# Altium schematic sheet Camera.SchDoc
size A3
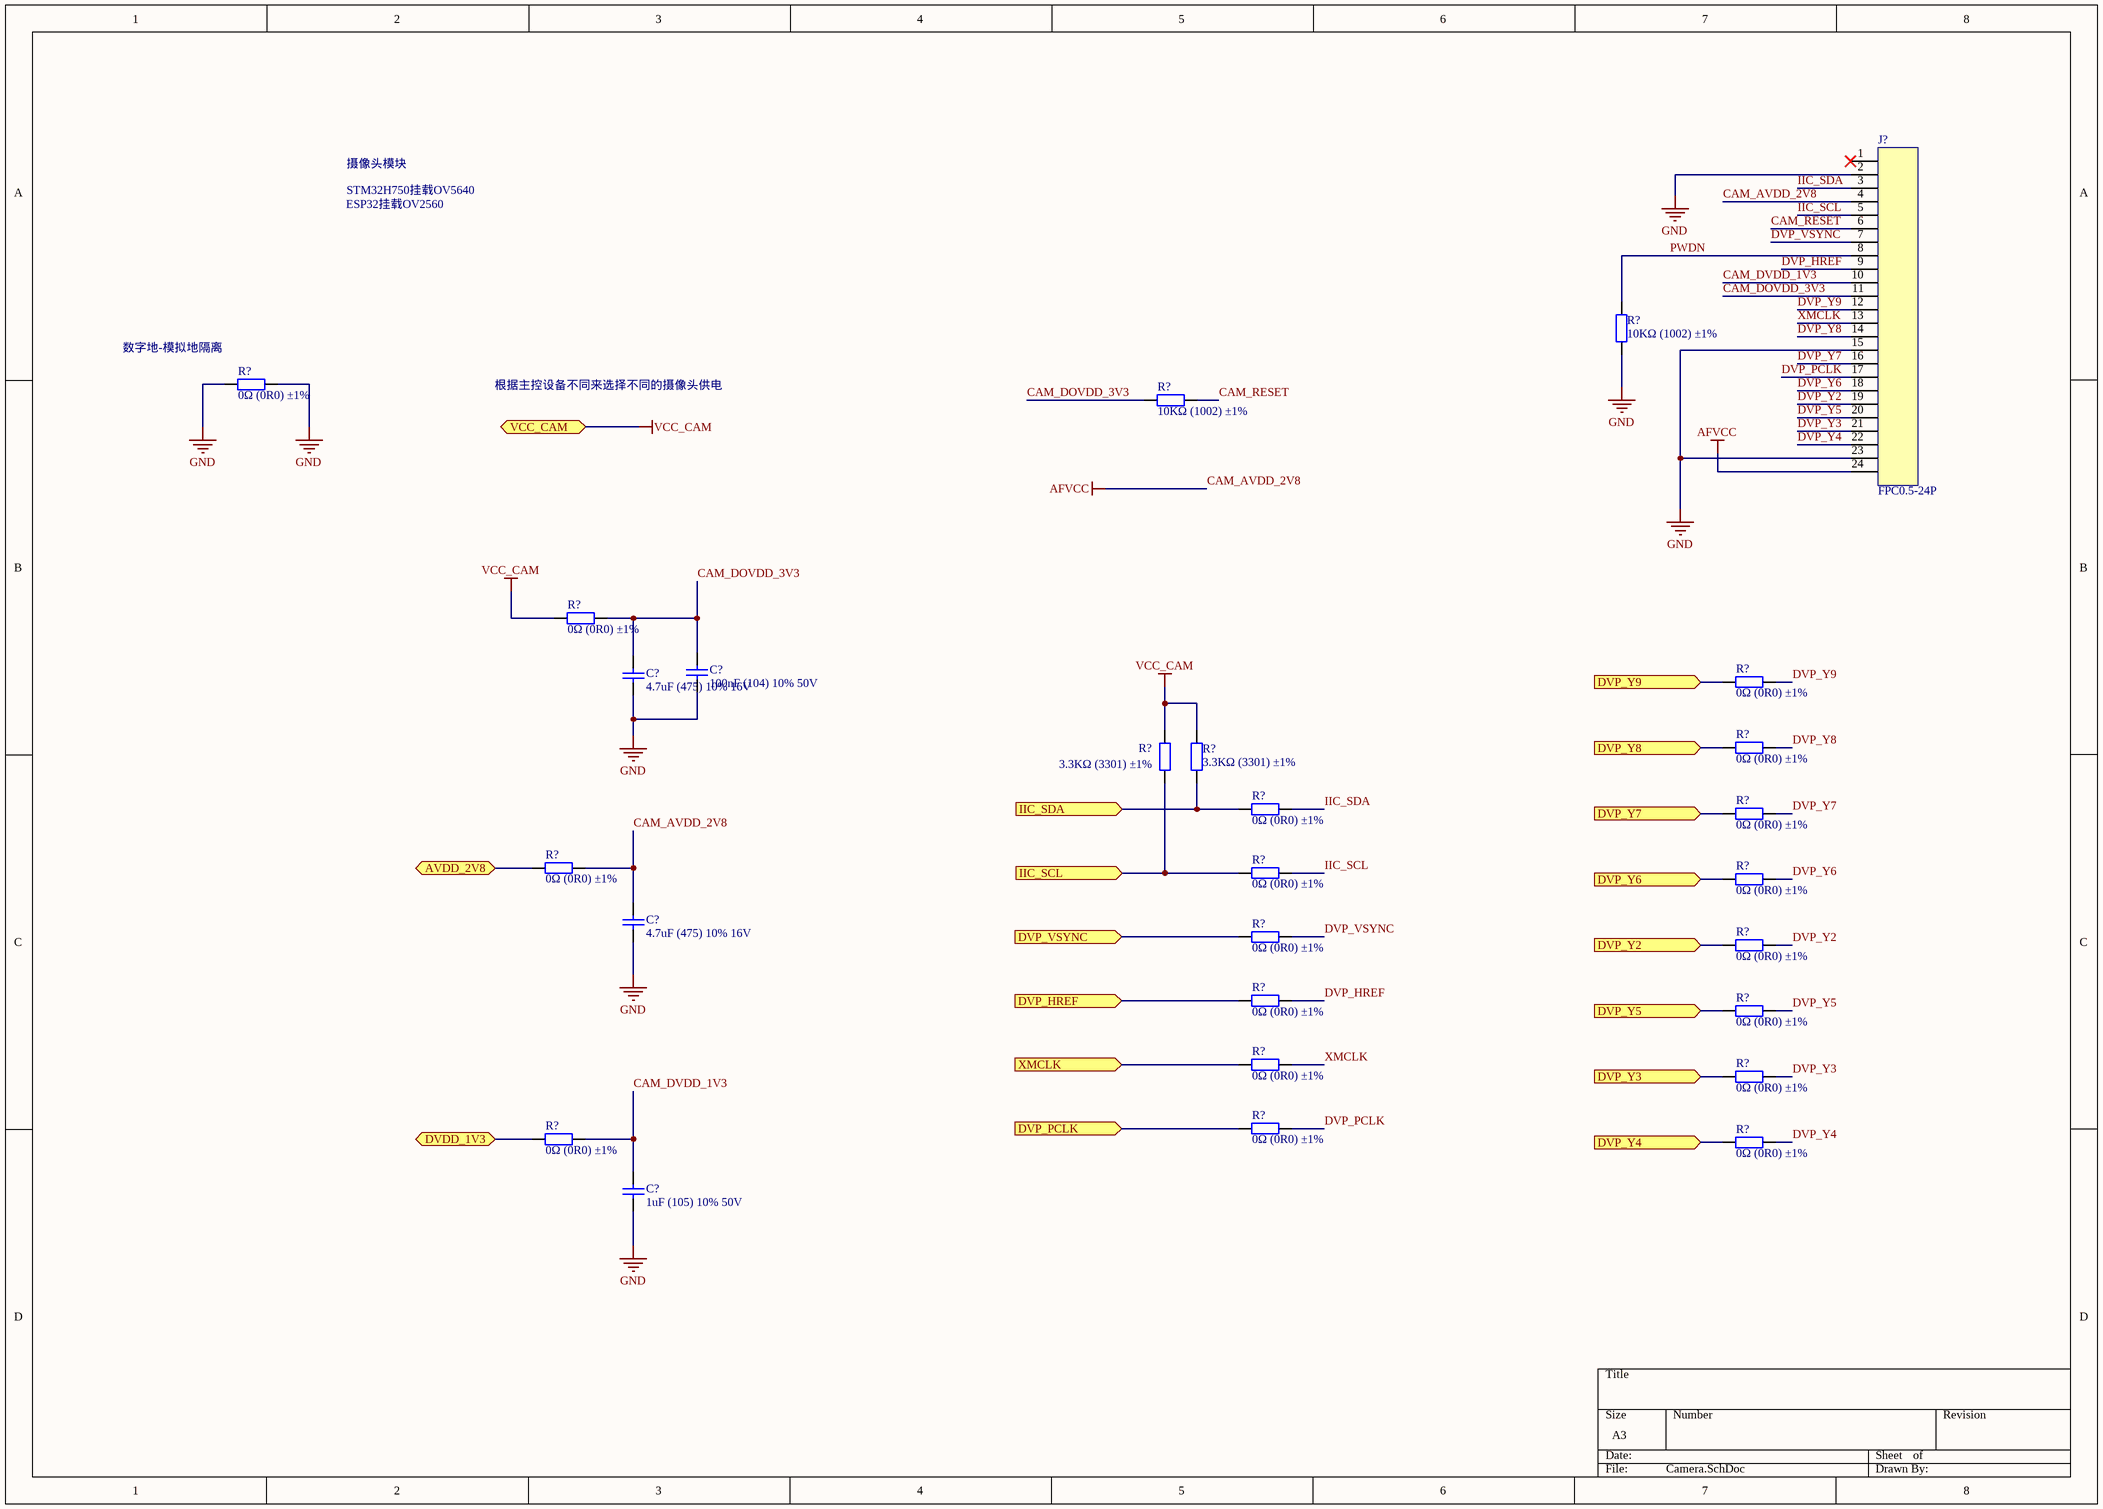
[diagram p0: Camera.SchDoc]

## Parts
(Parts that share a designator on the sheet are numbered #1, #2 ... from top to bottom, then left to right.)
C?#1  4.7uF (475) 10% 16V  [0603_C]
C?#2  100nF (104) 10% 50V  [0603_C]
C?#3  4.7uF (475) 10% 16V  [0603_C]
C?#4  1uF (105) 10% 50V  [0603_C]
J?  FPC0.5-24P  [FPC0.5-24P]
R?#1  10KΩ (1002) ±1%  [0603_R]
R?#2  0Ω (0R0) ±1%  [0603_R]
R?#3  10KΩ (1002) ±1%  [0603_R]
R?#4  0Ω (0R0) ±1%  [0603_R]
R?#5  0Ω (0R0) ±1%  [0603_R]
R?#6  0Ω (0R0) ±1%  [0603_R]
R?#7  3.3KΩ (3301) ±1%  [0603_R]
R?#8  3.3KΩ (3301) ±1%  [0603_R]
R?#9  0Ω (0R0) ±1%  [0603_R]
R?#10  0Ω (0R0) ±1%  [0603_R]
R?#11  0Ω (0R0) ±1%  [0603_R]
R?#12  0Ω (0R0) ±1%  [0603_R]
R?#13  0Ω (0R0) ±1%  [0603_R]
R?#14  0Ω (0R0) ±1%  [0603_R]
R?#15  0Ω (0R0) ±1%  [0603_R]
R?#16  0Ω (0R0) ±1%  [0603_R]
R?#17  0Ω (0R0) ±1%  [0603_R]
R?#18  0Ω (0R0) ±1%  [0603_R]
R?#19  0Ω (0R0) ±1%  [0603_R]
R?#20  0Ω (0R0) ±1%  [0603_R]
R?#21  0Ω (0R0) ±1%  [0603_R]
R?#22  0Ω (0R0) ±1%  [0603_R]

## Ports
AVDD_2V8 (bidir), DVDD_1V3 (bidir), DVP_HREF (in), DVP_PCLK (in), DVP_VSYNC (in), DVP_Y2 (in), DVP_Y3 (in), DVP_Y4 (in), DVP_Y5 (in), DVP_Y6 (in), DVP_Y7 (in), DVP_Y8 (in), DVP_Y9 (in), IIC_SCL (in), IIC_SDA (in), VCC_CAM (bidir), XMCLK (in)

## Nets
CAM_AVDD_2V8: C?#3.2 J?.4 J?.24 R?#11.1  [also labelled AFVCC]
GND: C?#1.1 C?#2.1 C?#3.1 C?#4.1 J?.2 J?.15 J?.23 R?#1.1 R?#2.1 R?#2.2
VCC_CAM: R?#4.2 R?#7.2 R?#8.2 ; port VCC_CAM
AVDD_2V8: R?#11.2 ; port AVDD_2V8
CAM_DOVDD_3V3: C?#1.2 C?#2.2 J?.11 R?#3.1 R?#4.1
CAM_DVDD_1V3: C?#4.2 J?.10 R?#21.1
CAM_RESET: J?.6 R?#3.2
DVDD_1V3: R?#21.2 ; port DVDD_1V3
DVP_HREF: R?#16.2 ; port DVP_HREF
DVP_HREF: J?.9 R?#16.1  [a separate net that carries the same name]
DVP_PCLK: R?#20.2 ; port DVP_PCLK
DVP_PCLK: J?.17 R?#20.1  [a separate net that carries the same name]
DVP_VSYNC: R?#14.2 ; port DVP_VSYNC
DVP_VSYNC: J?.7 R?#14.1  [a separate net that carries the same name]
DVP_Y2: R?#15.2 ; port DVP_Y2
DVP_Y2: J?.19 R?#15.1  [a separate net that carries the same name]
DVP_Y3: R?#19.2 ; port DVP_Y3
DVP_Y3: J?.21 R?#19.1  [a separate net that carries the same name]
DVP_Y4: R?#22.2 ; port DVP_Y4
DVP_Y4: J?.22 R?#22.1  [a separate net that carries the same name]
DVP_Y5: R?#17.2 ; port DVP_Y5
DVP_Y5: J?.20 R?#17.1  [a separate net that carries the same name]
DVP_Y6: R?#13.2 ; port DVP_Y6
DVP_Y6: J?.18 R?#13.1  [a separate net that carries the same name]
DVP_Y7: R?#10.2 ; port DVP_Y7
DVP_Y7: J?.16 R?#10.1  [a separate net that carries the same name]
DVP_Y8: R?#6.2 ; port DVP_Y8
DVP_Y8: J?.14 R?#6.1  [a separate net that carries the same name]
DVP_Y9: R?#5.2 ; port DVP_Y9
DVP_Y9: J?.12 R?#5.1  [a separate net that carries the same name]
IIC_SCL: R?#7.1 R?#12.2 ; port IIC_SCL
IIC_SCL: J?.5 R?#12.1  [a separate net that carries the same name]
IIC_SDA: R?#8.1 R?#9.2 ; port IIC_SDA
IIC_SDA: J?.3 R?#9.1  [a separate net that carries the same name]
PWDN: J?.8 R?#1.2
XMCLK: R?#18.2 ; port XMCLK
XMCLK: J?.13 R?#18.1  [a separate net that carries the same name]

Not connected (* = marked no-connect by the designer): J? 1*

## Notes on the sheet
- 摄像头模块
- ESP32挂载OV2560
- STM32H750挂载OV5640
- 数字地-模拟地隔离
- 根据主控设备不同来选择不同的摄像头供电

## Library data of the parts
C?#1 C?#3 = 0603 4.7uF (475) 10% 16V: 贴片电容; ComponentLink1Description: 供应商链接; ComponentLink1URL: http://www.szlcsc.com/product/details_20375.html; Package: 0603; Supplier: LC; SuppliersPartNumber: C19666
C?#2 = 0603 100nF (104) 10% 50V: 贴片电容; ComponentLink1Description: 供应商链接; ComponentLink1URL: http://www.szlcsc.com/product/details_15331.html; Package: 0603; Supplier: LC; SuppliersPartNumber: C14663
C?#4 = 0603 1uF (105) 10% 50V: 贴片电容; ComponentLink1Description: 供应商链接; ComponentLink1URL: http://www.szlcsc.com/product/details_16531.html; Package: 0603; Supplier: LC; SuppliersPartNumber: C15849
J? = FPC0.5-24P: 贴片
R?#1 R?#3 = 0603 10KΩ (1002) 1%: 贴片电阻; ComponentLink1Description: 供应商链接; ComponentLink1URL: http://www.szlcsc.com/product/details_26547.html; Package: 0603; Supplier: LC; SuppliersPartNumber: C25804
R?#2 R?#4-R?#6 R?#9-R?#22 = 0603 0Ω (0R0) 1%: 贴片电阻; ComponentLink1Description: 供应商链接; ComponentLink1URL: http://www.szlcsc.com/product/details_21903.html; Package: 0603; Supplier: LC; SuppliersPartNumber: C21189
R?#7 R?#8 = 0603 3.3KΩ (3301) 1%: 贴片电阻; ComponentLink1Description: 供应商链接; ComponentLink1URL: http://www.szlcsc.com/product/details_23705.html; Package: 0603; Supplier: LC; SuppliersPartNumber: C22978